# Altium schematic sheet AM-RAM.SchDoc
size B
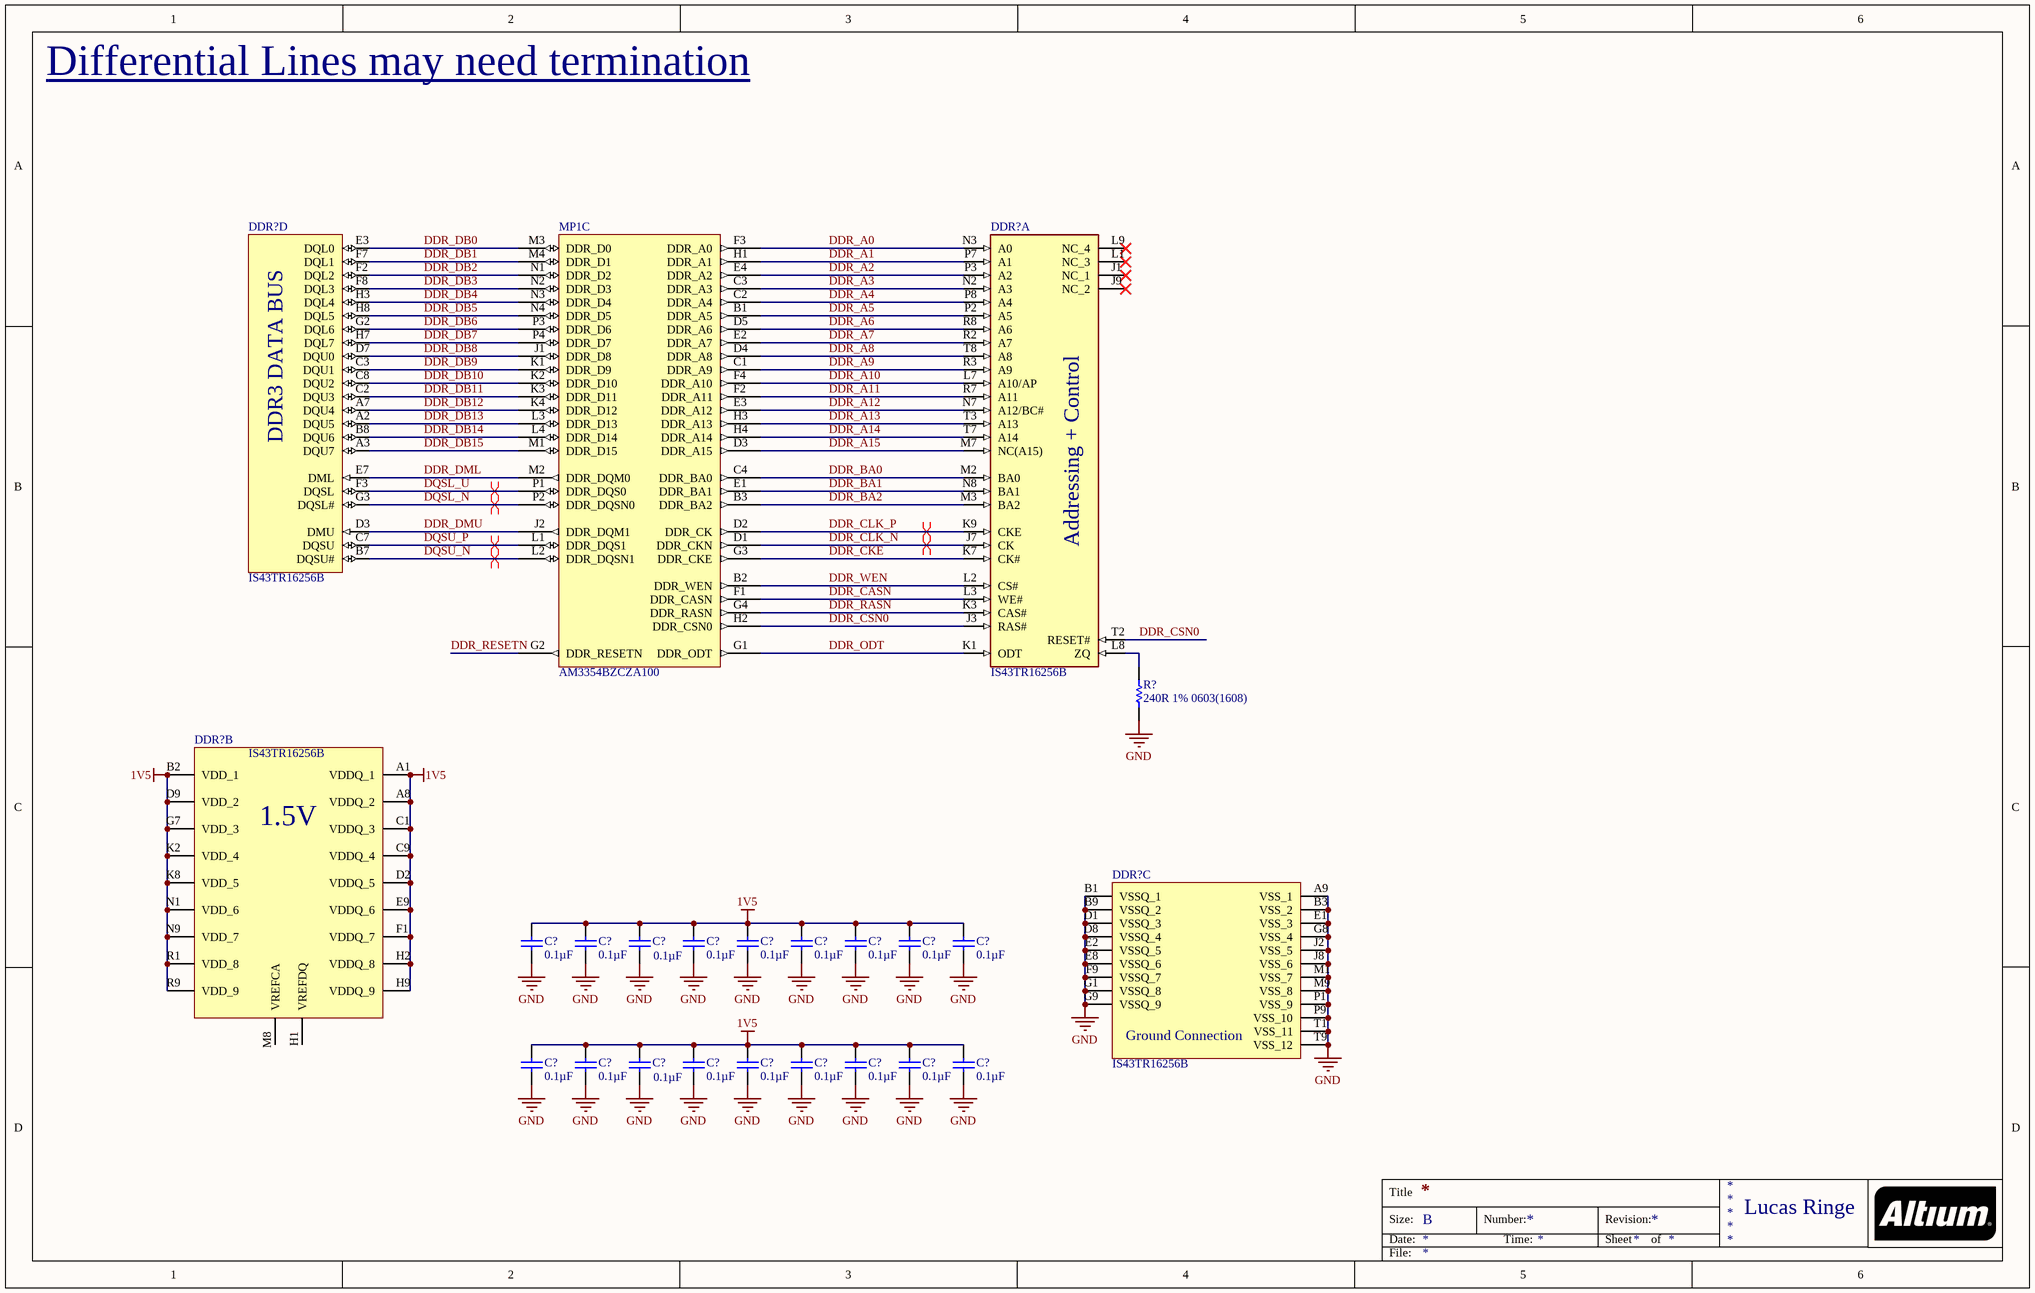
[diagram p0: AM-RAM.SchDoc]

## Parts
(Parts that share a designator on the sheet are numbered #1, #2 ... from top to bottom, then left to right.)
C?#1  Capacitance: 0.1µF  [SAMS-C0603-2_M]  (hidden comment: CL10B104KB8NNNC)
C?#2  Capacitance: 0.1µF  [SAMS-C0603-2_M]  (hidden comment: CL10B104KB8NNNC)
C?#3  Capacitance: 0.1µF  [SAMS-C0603-2_M]  (hidden comment: CL10B104KB8NNNC)
C?#4  Capacitance: 0.1µF  [SAMS-C0603-2_M]  (hidden comment: CL10B104KB8NNNC)
C?#5  Capacitance: 0.1µF  [SAMS-C0603-2_M]  (hidden comment: CL10B104KB8NNNC)
C?#6  Capacitance: 0.1µF  [SAMS-C0603-2_M]  (hidden comment: CL10B104KB8NNNC)
C?#7  Capacitance: 0.1µF  [SAMS-C0603-2_M]  (hidden comment: CL10B104KB8NNNC)
C?#8  Capacitance: 0.1µF  [SAMS-C0603-2_M]  (hidden comment: CL10B104KB8NNNC)
C?#9  Capacitance: 0.1µF  [SAMS-C0603-2_M]  (hidden comment: CL10B104KB8NNNC)
C?#10  Capacitance: 0.1µF  [SAMS-C0603-2_M]  (hidden comment: CL10B104KB8NNNC)
C?#11  Capacitance: 0.1µF  [SAMS-C0603-2_M]  (hidden comment: CL10B104KB8NNNC)
C?#12  Capacitance: 0.1µF  [SAMS-C0603-2_M]  (hidden comment: CL10B104KB8NNNC)
C?#13  Capacitance: 0.1µF  [SAMS-C0603-2_M]  (hidden comment: CL10B104KB8NNNC)
C?#14  Capacitance: 0.1µF  [SAMS-C0603-2_M]  (hidden comment: CL10B104KB8NNNC)
C?#15  Capacitance: 0.1µF  [SAMS-C0603-2_M]  (hidden comment: CL10B104KB8NNNC)
C?#16  Capacitance: 0.1µF  [SAMS-C0603-2_M]  (hidden comment: CL10B104KB8NNNC)
C?#17  Capacitance: 0.1µF  [SAMS-C0603-2_M]  (hidden comment: CL10B104KB8NNNC)
C?#18  Capacitance: 0.1µF  [SAMS-C0603-2_M]  (hidden comment: CL10B104KB8NNNC)
DDR?#1  IS43TR16256B  [BGA96C80P9X16_900X1300X120]  (part D of 4)
DDR?#2  IS43TR16256B  [BGA96C80P9X16_900X1300X120]  (part A of 4)
DDR?#3  IS43TR16256B  [BGA96C80P9X16_900X1300X120]  (part B of 4)
DDR?#4  IS43TR16256B  [BGA96C80P9X16_900X1300X120]  (part C of 4)
MP1  AM3354BZCZA100  [TI-ZCZ324]  (part C of 9)
R?  240R 1% 0603(1608)  [RESC0603(1608)_N]

## Nets
1V5: C?#1.2 C?#2.2 C?#3.2 C?#4.2 C?#5.2 C?#6.2 C?#7.2 C?#8.2 C?#9.2 C?#10.2 C?#11.2 C?#12.2 C?#13.2 C?#14.2 C?#15.2 C?#16.2 C?#17.2 C?#18.2 DDR?#3.A1(VDDQ_1) DDR?#3.A8(VDDQ_2) DDR?#3.B2(VDD_1) DDR?#3.C1(VDDQ_3) DDR?#3.C9(VDDQ_4) DDR?#3.D2(VDDQ_5) DDR?#3.D9(VDD_2) DDR?#3.E9(VDDQ_6) DDR?#3.F1(VDDQ_7) DDR?#3.G7(VDD_3) DDR?#3.H2(VDDQ_8) DDR?#3.H9(VDDQ_9) DDR?#3.K2(VDD_4) DDR?#3.K8(VDD_5) DDR?#3.N1(VDD_6) DDR?#3.N9(VDD_7) DDR?#3.R1(VDD_8) DDR?#3.R9(VDD_9)
GND: C?#1.1 C?#2.1 C?#3.1 C?#4.1 C?#5.1 C?#6.1 C?#7.1 C?#8.1 C?#9.1 C?#10.1 C?#11.1 C?#12.1 C?#13.1 C?#14.1 C?#15.1 C?#16.1 C?#17.1 C?#18.1 DDR?#4.A9(VSS_1) DDR?#4.B1(VSSQ_1) DDR?#4.B3(VSS_2) DDR?#4.B9(VSSQ_2) DDR?#4.D1(VSSQ_3) DDR?#4.D8(VSSQ_4) DDR?#4.E1(VSS_3) DDR?#4.E2(VSSQ_5) DDR?#4.E8(VSSQ_6) DDR?#4.F9(VSSQ_7) DDR?#4.G1(VSSQ_8) DDR?#4.G8(VSS_4) DDR?#4.G9(VSSQ_9) DDR?#4.J2(VSS_5) DDR?#4.J8(VSS_6) DDR?#4.M1(VSS_7) DDR?#4.M9(VSS_8) DDR?#4.P1(VSS_9) DDR?#4.P9(VSS_10) DDR?#4.T1(VSS_11) DDR?#4.T9(VSS_12) R?.1
DDR_A0: DDR?#2.N3(A0) MP1.F3(DDR_A0)
DDR_A1: DDR?#2.P7(A1) MP1.H1(DDR_A1)
DDR_A2: DDR?#2.P3(A2) MP1.E4(DDR_A2)
DDR_A3: DDR?#2.N2(A3) MP1.C3(DDR_A3)
DDR_A4: DDR?#2.P8(A4) MP1.C2(DDR_A4)
DDR_A5: DDR?#2.P2(A5) MP1.B1(DDR_A5)
DDR_A6: DDR?#2.R8(A6) MP1.D5(DDR_A6)
DDR_A7: DDR?#2.R2(A7) MP1.E2(DDR_A7)
DDR_A8: DDR?#2.T8(A8) MP1.D4(DDR_A8)
DDR_A9: DDR?#2.R3(A9) MP1.C1(DDR_A9)
DDR_A10: DDR?#2.L7(A10/AP) MP1.F4(DDR_A10)
DDR_A11: DDR?#2.R7(A11) MP1.F2(DDR_A11)
DDR_A1~{2}: DDR?#2.N7(A12/BC#) MP1.E3(DDR_A12)
DDR_A13: DDR?#2.T3(A13) MP1.H3(DDR_A13)
DDR_A14: DDR?#2.T7(A14) MP1.H4(DDR_A14)
DDR_A15: DDR?#2.M7(NC(A15)) MP1.D3(DDR_A15)
DDR_BA0: DDR?#2.M2(BA0) MP1.C4(DDR_BA0)
DDR_BA1: DDR?#2.N8(BA1) MP1.E1(DDR_BA1)
DDR_BA2: DDR?#2.M3(BA2) MP1.B3(DDR_BA2)
DDR_CASN: DDR?#2.L3(WE#) MP1.F1(DDR_CASN)
DDR_CKE: DDR?#2.K7(CK#) MP1.G3(DDR_CKE)
DDR_CLK_N: DDR?#2.J7(CK) MP1.D1(DDR_CKN)
DDR_CLK_P: DDR?#2.K9(CKE) MP1.D2(DDR_CK)
DDR_CSN0: DDR?#2.J3(RAS#) DDR?#2.T2(RESET#) MP1.H2(DDR_CSN0)
DDR_DB0: DDR?#1.E3(DQL0) MP1.M3(DDR_D0)
DDR_DB1: DDR?#1.F7(DQL1) MP1.M4(DDR_D1)
DDR_DB2: DDR?#1.F2(DQL2) MP1.N1(DDR_D2)
DDR_DB3: DDR?#1.F8(DQL3) MP1.N2(DDR_D3)
DDR_DB4: DDR?#1.H3(DQL4) MP1.N3(DDR_D4)
DDR_DB5: DDR?#1.H8(DQL5) MP1.N4(DDR_D5)
DDR_DB6: DDR?#1.G2(DQL6) MP1.P3(DDR_D6)
DDR_DB7: DDR?#1.H7(DQL7) MP1.P4(DDR_D7)
DDR_DB8: DDR?#1.D7(DQU0) MP1.J1(DDR_D8)
DDR_DB9: DDR?#1.C3(DQU1) MP1.K1(DDR_D9)
DDR_DB10: DDR?#1.C8(DQU2) MP1.K2(DDR_D10)
DDR_DB11: DDR?#1.C2(DQU3) MP1.K3(DDR_D11)
DDR_DB12: DDR?#1.A7(DQU4) MP1.K4(DDR_D12)
DDR_DB13: DDR?#1.A2(DQU5) MP1.L3(DDR_D13)
DDR_DB14: DDR?#1.B8(DQU6) MP1.L4(DDR_D14)
DDR_DB15: DDR?#1.A3(DQU7) MP1.M1(DDR_D15)
DDR_DML: DDR?#1.E7(DML) MP1.M2(DDR_DQM0)
DDR_DMU: DDR?#1.D3(DMU) MP1.J2(DDR_DQM1)
DDR_ODT: DDR?#2.K1(ODT) MP1.G1(DDR_ODT)
DDR_RASN: DDR?#2.K3(CAS#) MP1.G4(DDR_RASN)
DDR_RESETN: MP1.G2(DDR_RESETN)
DDR_WEN: DDR?#2.L2(CS#) MP1.B2(DDR_WEN)
DQSL_N: DDR?#1.G3(DQSL#) MP1.P2(DDR_DQSN0)
DQSL_U: DDR?#1.F3(DQSL) MP1.P1(DDR_DQS0)
DQSU_N: DDR?#1.B7(DQSU#) MP1.L2(DDR_DQSN1)
DQSU_P: DDR?#1.C7(DQSU) MP1.L1(DDR_DQS1)
NetDDR?#2_L8: DDR?#2.L8(ZQ) R?.2

Not connected (* = marked no-connect by the designer): DDR?#2 J1(NC_1)* J9(NC_2)* L1(NC_3)* L9(NC_4)*; DDR?#3 H1(VREFDQ) M8(VREFCA)

## Layout directives
differential pair: DDR_CLK_N, DDR_CLK_P, DQSL_N, DQSL_U, DQSU_N, DQSU_P

## Notes on the sheet
- Differential Lines may need termination <https://www.nxp.com/files-static/32bit/doc/app_note/AN3940.pdf>
- Lucas Ringe
- Title
- Size:
- Date:
- B
- Number:
- Time:
- Revision:
- Sheet
- of
- File:
- (in symbol IS43TR16256B, part A) Addressing + Control
- (in symbol IS43TR16256B, part B) 1.5V
- (in symbol IS43TR16256B, part C) Ground Connection
- (in symbol IS43TR16256B, part D) DDR3 DATA BUS

## Library data of the parts
C?#1-C?#18 = CMP-2000-05332-1: Multi-layer Ceramic Capacitor, -55 to 125 degC, 2-Pin SMD (0603), RoHS, Tape and Reel; Manufacturer: Samsung Electro-Mechanics; Rated Voltage: 50V; Dielectric: X7R; Tolerance (%): ±10%; Case Size/Dimension: 0603; Datasheet URL: https://datasheet.ciiva.com/29198/456651-da-01-en-vs-kondensator-0605-29198839.pdf; Manufacturer URL: http://www.samsungsem.com/global/index.jsp; Datasheet Version: Nov-10
DDR?#1-DDR?#4 = IS43TR16256B: Integrated Circuit; Manufacturer_Name: Integrated Silicon Solution Inc.; Manufacturer_Part_Number: IS43TR16256B-125KBL; Datasheet Link: https://componentsearchengine.com//IS43TR16256B-125KBL.pdf; Height: 1.2mm; Mouser2 Part Number: 870-43T16256B125KBL; Mouser2 Price/Stock: https://www.mouser.com/Search/Refine.aspx?Keyword=870-43T16256B125KBL
MP1 = CMP-0547-00017-2: Sitara ARM Cortex-A8 32-Bit RISC Microprocessor, 1 GHz, SGX530 3D Graphics Engine, Programmable Real-Time Unit and Industrial Communication Subsystem (PRU-ICSS), -40 to 105 degC, 324-pin NFBGA (ZCZ), Green (RoHS & no Sb/Br); Manufacturer: Texas Instruments; eQEP: 3; CAN: 2; UART (SCI): 6; ComponentLink2Description: Datasheet; Mounting Technology: Surface Mount; ComponentLink3Description: Package Specification; Operating Temperature: -40 to 105 degC; PackageReference: ZCZ324; ComponentLink3URL: http://www.ti.com/lit/ds/symlink/am3352.pdf; ARM CPU: Cortex-A8; SPI: 2; ComponentLink2URL: http://www.ti.com/lit/ds/symlink/am3352.pdf; ComponentLink1URL: http://www.ti.com/; PackageVersion: 4211570/A; DatasheetVersion: SPRS717F; eCAP: 3; ComponentLink1Description: Manufacturer URL; PartNumber: AM3354BZCZA100; I2C: 3; PackageDescription: 324-Pin Plastic Ball Grid Array, Body 15 x 15 mm, Pitch 0.8 mm
R? = CMP-1012-00438-1: 240R 0.1W 1% 0603 (1608 Metric)  SMD; Case-EIA: 0603; Value: 240.00 Ohm; Case-Metric: 1608; Technology: SMT; Power: 0.1 W; Tolerance: 1 %